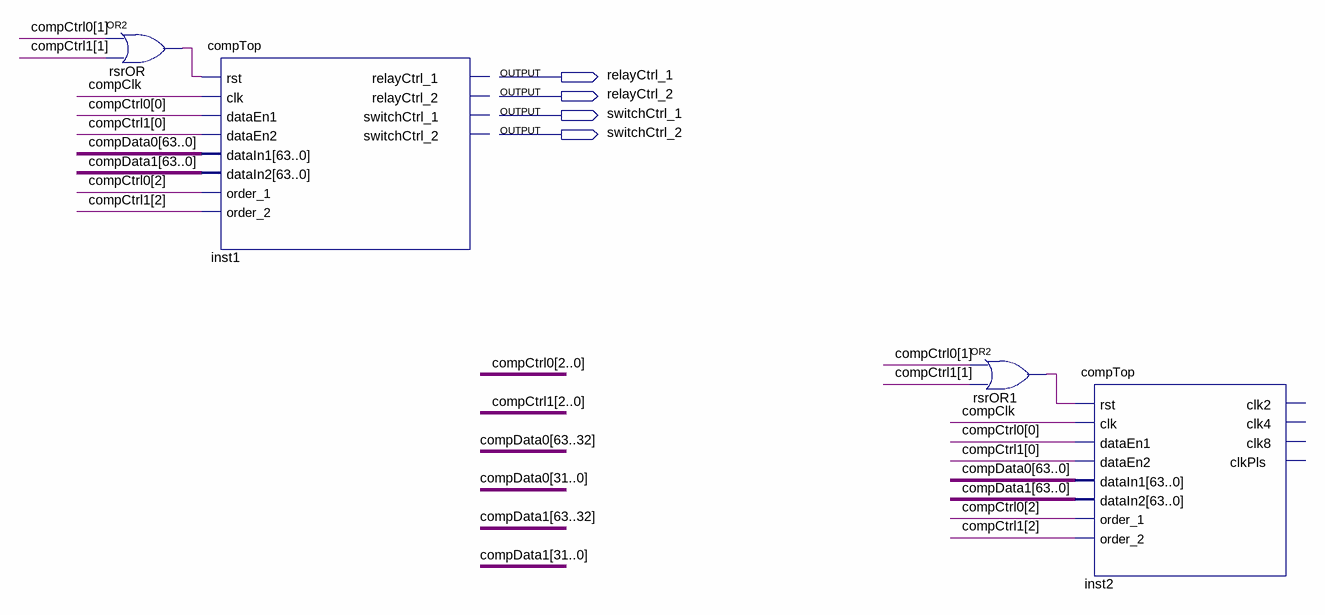
[diagram p0: schematic sheet]
// Quartus schematic comparator.bdf as structural Verilog: 4 symbols, 4 pins
module comparator (
  output relayCtrl_1,
  output relayCtrl_2,
  output switchCtrl_1,
  output switchCtrl_2
);

  wire compClk, rsrOR1_out, rsrOR_out;
  wire [2:0] compCtrl0, compCtrl1;
  wire [63:0] compData0, compData1;

  or rsrOR (rsrOR_out, compCtrl0[1], compCtrl1[1]);
  compTop inst1 (
    .rst(rsrOR_out), .clk(compClk), .dataEn1(compCtrl0[0]), .dataEn2(compCtrl1[0]), .dataIn1(compData0),
    .dataIn2(compData1), .order_1(compCtrl0[2]), .order_2(compCtrl1[2]));  // open: relayCtrl_1, relayCtrl_2, switchCtrl_1, switchCtrl_2
  or rsrOR1 (rsrOR1_out, compCtrl0[1], compCtrl1[1]);
  compTop inst2 (
    .rst(rsrOR1_out), .clk(compClk), .dataEn1(compCtrl0[0]), .dataEn2(compCtrl1[0]), .dataIn1(compData0),
    .dataIn2(compData1), .order_1(compCtrl0[2]), .order_2(compCtrl1[2]));  // open: clk2, clk4, clk8, clkPls
endmodule
